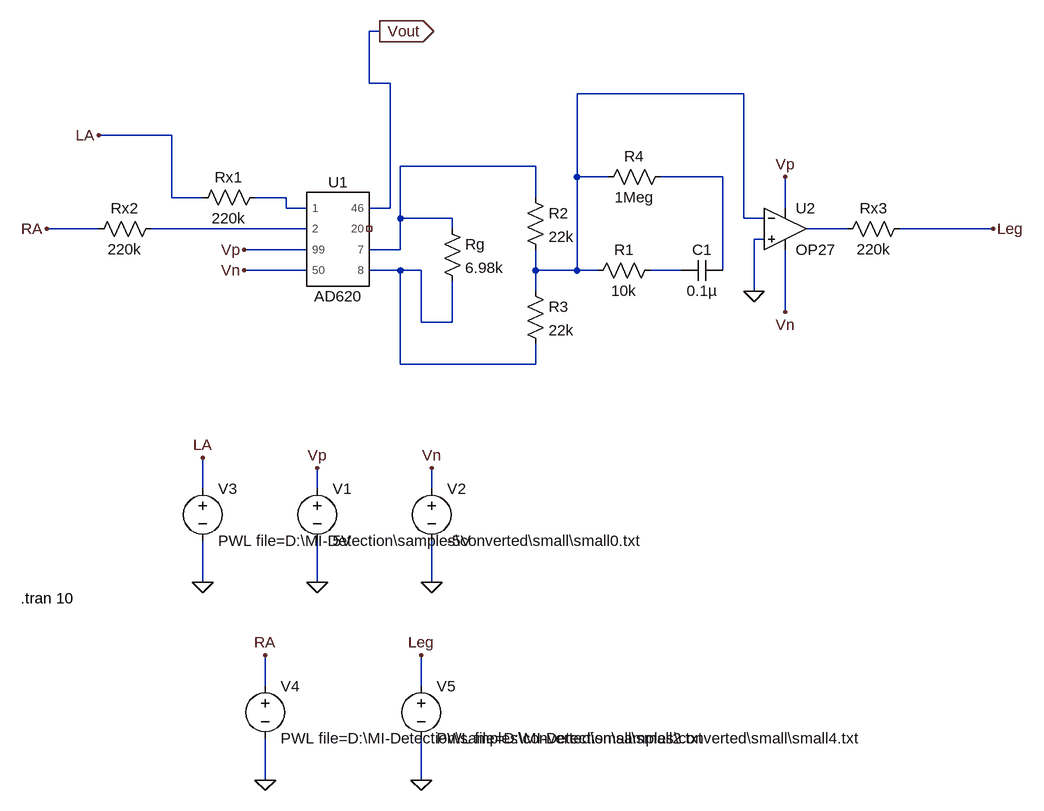
[diagram p0: schematic Draft1.asc]
Draft1.asc, the LTspice schematic file:
Version 4
SHEET 1 1340 1028
WIRE 336 -144 320 -144
WIRE 320 -64 320 -144
WIRE 352 -64 320 -64
WIRE 896 -48 640 -48
WIRE 16 16 -96 16
WIRE 576 64 368 64
WIRE 640 80 640 -48
WIRE 688 80 640 80
WIRE 864 80 768 80
WIRE 16 112 16 16
WIRE 64 112 16 112
WIRE 192 112 144 112
WIRE 576 112 576 64
WIRE 192 128 192 112
WIRE 224 128 192 128
WIRE 352 128 352 -64
WIRE 352 128 320 128
WIRE 960 128 960 80
WIRE 368 144 368 64
WIRE 448 144 368 144
WIRE 896 144 896 -48
WIRE 928 144 896 144
WIRE -96 160 -176 160
WIRE 224 160 -16 160
WIRE 448 160 448 144
WIRE 1056 160 992 160
WIRE 1280 160 1136 160
WIRE 928 176 912 176
WIRE 224 192 128 192
WIRE 368 192 368 144
WIRE 368 192 320 192
WIRE 224 224 128 224
WIRE 368 224 320 224
WIRE 400 224 368 224
WIRE 576 224 576 192
WIRE 640 224 640 80
WIRE 640 224 576 224
WIRE 672 224 640 224
WIRE 800 224 752 224
WIRE 864 224 864 80
WIRE 576 256 576 224
WIRE 912 256 912 176
WIRE 960 288 960 192
WIRE 400 304 400 224
WIRE 448 304 448 240
WIRE 448 304 400 304
WIRE 368 368 368 224
WIRE 576 368 576 336
WIRE 576 368 368 368
WIRE 64 560 64 512
WIRE 240 560 240 528
WIRE 416 560 416 528
WIRE 64 704 64 640
WIRE 240 704 240 640
WIRE 416 704 416 640
WIRE 160 864 160 816
WIRE 400 864 400 816
WIRE 160 1008 160 944
WIRE 400 1008 400 944
FLAG 912 256 0
FLAG 240 704 0
FLAG 960 80 Vp
FLAG 240 528 Vp
FLAG 416 704 0
FLAG 416 528 Vn
FLAG 960 288 Vn
FLAG 128 192 Vp
FLAG 128 224 Vn
FLAG 336 -144 Vout
IOPIN 336 -144 Out
FLAG 64 512 LA
FLAG 64 704 0
FLAG -176 160 RA
FLAG 160 816 RA
FLAG 160 1008 0
FLAG 400 816 Leg
FLAG 400 1008 0
FLAG -96 16 LA
FLAG 1280 160 Leg
SYMBOL conditioner 272 176 R0
SYMATTR InstName U1
SYMBOL res 432 144 R0
SYMATTR InstName Rg
SYMATTR Value 6.98k
SYMBOL res 560 96 R0
SYMATTR InstName R2
SYMATTR Value 22k
SYMBOL res 560 240 R0
SYMATTR InstName R3
SYMATTR Value 22k
SYMBOL res 768 208 R90
WINDOW 0 0 56 VBottom 2
WINDOW 3 32 56 VTop 2
SYMATTR InstName R1
SYMATTR Value 10k
SYMBOL cap 864 208 R90
WINDOW 0 0 32 VBottom 2
WINDOW 3 32 32 VTop 2
SYMATTR InstName C1
SYMATTR Value 0.1µ
SYMBOL res 784 64 R90
WINDOW 0 0 56 VBottom 2
WINDOW 3 32 56 VTop 2
SYMATTR InstName R4
SYMATTR Value 1Meg
SYMBOL OpAmps\\OP27 960 96 R0
SYMATTR InstName U2
SYMBOL voltage 240 544 R0
WINDOW 123 0 0 Left 0
WINDOW 39 0 0 Left 0
SYMATTR InstName V1
SYMATTR Value 5V
SYMBOL voltage 416 544 R0
WINDOW 123 0 0 Left 0
WINDOW 39 0 0 Left 0
SYMATTR InstName V2
SYMATTR Value -5V
SYMBOL res 1152 144 R90
WINDOW 0 0 56 VBottom 2
WINDOW 3 32 56 VTop 2
SYMATTR InstName Rx3
SYMATTR Value 220k
SYMBOL res 0 144 R90
WINDOW 0 0 56 VBottom 2
WINDOW 3 32 56 VTop 2
SYMATTR InstName Rx2
SYMATTR Value 220k
SYMBOL res 160 96 R90
WINDOW 0 0 56 VBottom 2
WINDOW 3 32 56 VTop 2
SYMATTR InstName Rx1
SYMATTR Value 220k
SYMBOL voltage 64 544 R0
WINDOW 123 0 0 Left 0
WINDOW 39 0 0 Left 0
SYMATTR InstName V3
SYMATTR Value PWL file=D:\MI-Detection\samples\converted\small\small0.txt
SYMBOL voltage 160 848 R0
WINDOW 123 0 0 Left 0
WINDOW 39 0 0 Left 0
SYMATTR InstName V4
SYMATTR Value PWL file=D:\MI-Detection\samples\converted\small\small2.txt
SYMBOL voltage 400 848 R0
WINDOW 123 0 0 Left 0
WINDOW 39 0 0 Left 0
SYMATTR InstName V5
SYMATTR Value PWL file=D:\MI-Detection\samples\converted\small\small4.txt
TEXT -216 728 Left 2 !.tran 10

The netlist it stands for:
* Draft1.asc
XU1 N004 N005 Vp Vn Vout NC_01 N002 N007 AD620  ; pins 1 2 99 50 46 20 7 8
Rg N002 N007 6.98k
R2 N002 N001 22k
R3 N001 N007 22k
R1 N008 N001 10k
C1 N003 N008 0.1µ
R4 N003 N001 1Meg
XU2 0 N001 Vp Vn N006 OP27  ; pins In+ In- V+ V- OUT
V1 Vp 0 5V
V2 Vn 0 -5V
Rx3 Leg N006 220k
Rx2 N005 RA 220k
Rx1 N004 LA 220k
V3 LA 0 PWL file=D:\MI-Detection\samples\converted\small\small0.txt
V4 RA 0 PWL file=D:\MI-Detection\samples\converted\small\small2.txt
V5 Leg 0 PWL file=D:\MI-Detection\samples\converted\small\small4.txt
.tran 10
.lib C:\Users\Rudra\Downloads\ad620.cir
.lib ADI.lib
.backanno
.end